# Altium project AD605.PrjPcb
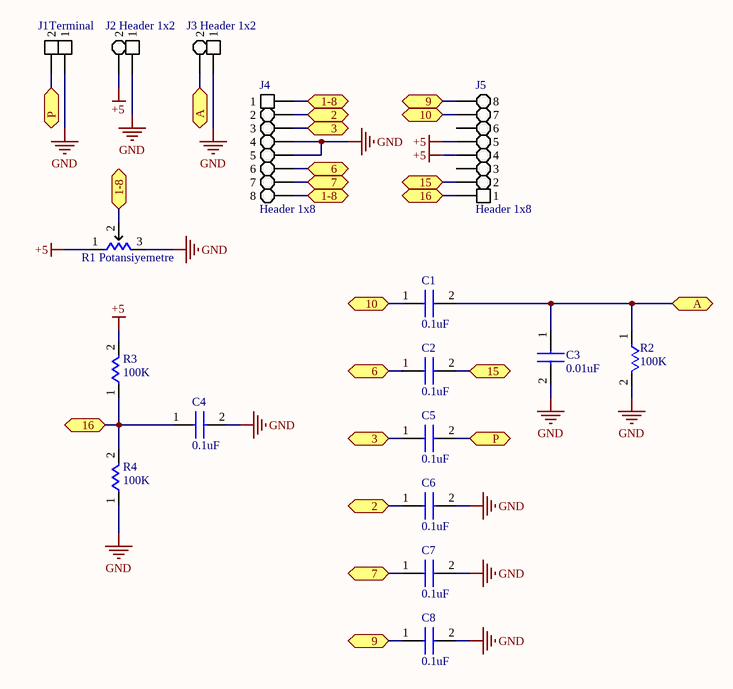
[diagram p0: AD_605_Sheet1.SchDoc]
1 sheet, 17 parts. Net scope: flat (ports and power ports of the same name join across sheets).
Board file: AD_605_PCB1.PcbDoc

## Sheet AD_605_Sheet1.SchDoc
size A3; SheetNumber: 1; SheetTotal: 1

### Parts
C1  0.1uF  [CAP]
C2  0.1uF  [CAP]
C3  0.01uF  [CAP]
C4  0.1uF  [CAP]
C5  0.1uF  [CAP]
C6  0.1uF  [CAP]
C7  0.1uF  [CAP]
C8  0.1uF  [CAP]
J1  Terminal  [Terminal]
J2  Header 1x2  [Header 1x2]
J3  Header 1x2  [Header 1x2]
J4  Header 1x8  [Header 1x8]
J5  Header 1x8  [Header 1x8]
R1  Potansiyemetre  [Potansiyemetre]
R2  100K  [THT Res]
R3  100K  [THT Res]
R4  100K  [THT Res]

### Ports
1-8 (bidir), 2 (bidir), 3 (bidir), 6 (bidir), 7 (bidir), 9 (bidir), 10 (bidir), 15 (bidir), 16 (bidir), A (bidir), P (bidir)

### Nets
+5: J2.2 J5.4 J5.5 R1.1 R3.2
GND: C3.2 C4.2 C6.2 C7.2 C8.2 J1.1 J2.1 J3.1 J4.4 J4.5 R1.3 R2.2 R4.1
NetC1_1: C1.1 J5.7 ; port 10
NetC1_2: C1.2 C3.1 J3.2 R2.1 ; port A
NetC2_1: C2.1 J4.6 ; port 6
NetC2_2: C2.2 J5.2 ; port 15
NetC4_1: C4.1 J5.1 R3.1 R4.2 ; port 16
NetC5_1: C5.1 J4.3 ; port 3
NetC5_2: C5.2 J1.2 ; port P
NetC6_1: C6.1 J4.2 ; port 2
NetC7_1: C7.1 J4.7 ; port 7
NetC8_1: C8.1 J5.8 ; port 9
NetJ4_1: J4.1 J4.8 R1.2 ; port 1-8

Not connected (* = marked no-connect by the designer): J5 3 6

### Library data of the parts
C1-C8 = CAP: Capacitor; ComponentLink1Description: Satın Alma Linki; ComponentLink1URL: https://www.robotistan.com/10nf-seramik-kondansator-paketi-10-adet; ComponentLink2Description: Satın Alma Linki; ComponentLink2URL: https://www.robotistan.com/1nf-seramik-kondansator-paketi-10-adet
J2 J3 = Header 1x2: Header; ComponentLink3Description: Satın Alma Linki; ComponentLink3URL: https://www.robotistan.com/1x40-180-12mm
J4 J5 = Header 1x8: Header; ComponentLink3Description: Satın Alma Linki; ComponentLink3URL: https://www.robotistan.com/1x40-180-12mm
R2-R4 = THT RES: ComponentLink1Description: Satın Alma Linki; ComponentLink1URL: https://www.robotistan.com/14w-10k-direnc-paketi-10-adet; ComponentLink2Description: Satın Alma Linki; ComponentLink2URL: https://www.robotistan.com/14w-56k-direnc-paketi-10-adet; ComponentLink3Description: Satın Alma Linki; ComponentLink3URL: https://www.robotistan.com/14w-1k-direnc-paketi-10-adet; ComponentLink4Description: Satın Alma Linki; ComponentLink4URL: https://www.robomarket.com.tr/6-2k-direnc-1-adet-1-4w; ComponentLink5Description: Satın Alma Linki; ComponentLink5URL: https://www.robotistan.com/12w-75k-10-adet; ComponentLink6Description: Satın Alma Linki; ComponentLink6URL: https://www.direnc.net/75k-14w-metalfilm-direnc-paketi-100-adet-1?language=tr&h=cb2d2062; ComponentLink7Description: Satın Alma Linki; ComponentLink7URL: https://www.robotistan.com/14w-4k7-direnc-paketi-10-adet; ComponentLink8Description: Satın Alma Linki; ComponentLink8URL: https://www.robotistan.com/2w-120k; ComponentLink9Description: Satın Alma Linki; ComponentLink9URL: https://www.robotistan.com/14w-3k9-direnc-paketi-10-adet?language=tr&h=0f40f5ee&gclid=CjwKCAjwxOCRBhA8EiwA0X8hi8jDuTXAWIdHih4LhQcB3YXTjEJ8OgB0uW3rlfstCae65K6p5gflnBoC2EgQAvD_BwE; ComponentLink10Description: Satın Alma Linki; ComponentLink10URL: https://www.motorobit.com/urun/3-3m-1-4w-direnc-10-adet
J1 = Terminal: ComponentLink1Description: Satın Alma Linki; ComponentLink1URL: *; ComponentLink2Description: Datasheet; ComponentLink2URL: *
R1 = Potansiyemetre: ComponentLink1Description: Satın Alma Linki; ComponentLink1URL: *; ComponentLink2Description: Datasheet; ComponentLink2URL: *